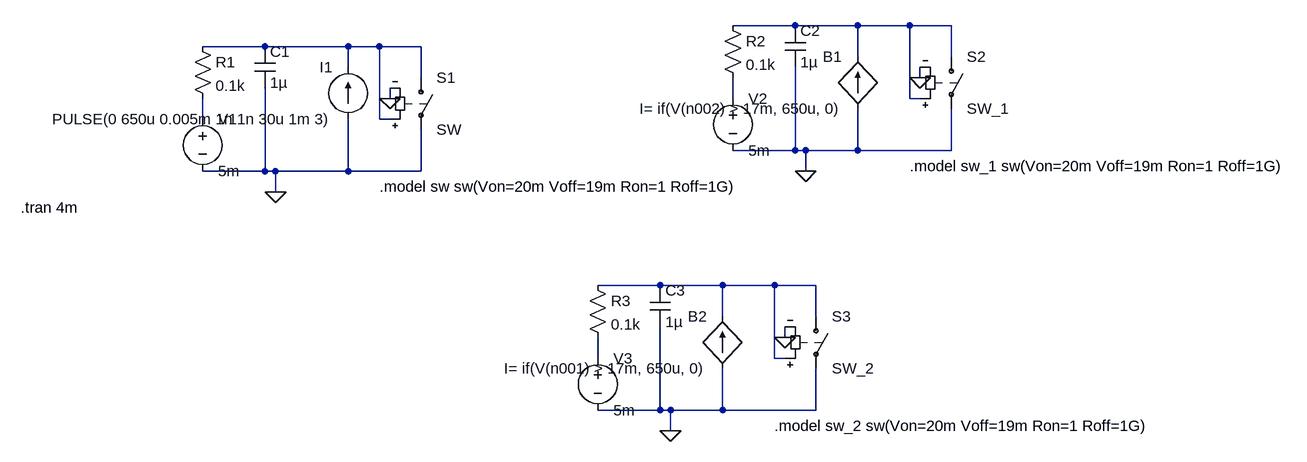
[diagram p0: schematic Neuron_1.asc]
Neuron_1.asc, the LTspice schematic file:
Version 4.1
SHEET 1 1820 708
WIRE 1008 64 912 64
WIRE 1104 64 1008 64
WIRE 1184 64 1104 64
WIRE 1248 64 1184 64
WIRE 192 96 96 96
WIRE 320 96 192 96
WIRE 368 96 320 96
WIRE 432 96 368 96
WIRE 1104 112 1104 64
WIRE 1248 112 1248 64
WIRE 320 128 320 96
WIRE 432 144 432 96
WIRE 1200 144 1200 128
WIRE 384 176 384 160
WIRE 912 176 912 144
WIRE 1184 176 1184 64
WIRE 1200 176 1184 176
WIRE 96 208 96 176
WIRE 368 208 368 96
WIRE 384 208 368 208
WIRE 1008 256 1008 128
WIRE 1008 256 912 256
WIRE 1024 256 1008 256
WIRE 1104 256 1104 192
WIRE 1104 256 1024 256
WIRE 1248 256 1248 192
WIRE 1248 256 1104 256
WIRE 192 288 192 160
WIRE 192 288 96 288
WIRE 208 288 192 288
WIRE 320 288 320 208
WIRE 320 288 208 288
WIRE 432 288 432 224
WIRE 432 288 320 288
WIRE 1024 288 1024 256
WIRE 208 320 208 288
WIRE 800 464 704 464
WIRE 896 464 800 464
WIRE 976 464 896 464
WIRE 1040 464 976 464
WIRE 896 512 896 464
WIRE 1040 512 1040 464
WIRE 992 544 992 528
WIRE 704 576 704 544
WIRE 976 576 976 464
WIRE 992 576 976 576
WIRE 800 656 800 528
WIRE 800 656 704 656
WIRE 816 656 800 656
WIRE 896 656 896 592
WIRE 896 656 816 656
WIRE 1040 656 1040 592
WIRE 1040 656 896 656
WIRE 816 688 816 656
FLAG 208 320 0
FLAG 384 176 0
FLAG 1024 288 0
FLAG 1200 144 0
FLAG 816 688 0
FLAG 992 544 0
SYMBOL res 80 80 R0
SYMATTR InstName R1
SYMATTR Value 0.1k
SYMBOL cap 176 96 R0
SYMATTR InstName C1
SYMATTR Value 1µ
SYMBOL voltage 96 192 R0
SYMATTR InstName V1
SYMATTR Value 5m
SYMBOL current 320 208 R180
WINDOW 0 24 80 Left 2
WINDOW 3 24 0 Left 2
WINDOW 123 0 0 Left 0
WINDOW 39 0 0 Left 0
SYMATTR InstName I1
SYMATTR Value PULSE(0 650u 0.005m 1n 1n 30u 1m 3)
SYMBOL sw 432 128 R0
SYMATTR InstName S1
SYMBOL res 896 48 R0
SYMATTR InstName R2
SYMATTR Value 0.1k
SYMBOL cap 992 64 R0
SYMATTR InstName C2
SYMATTR Value 1µ
SYMBOL voltage 912 160 R0
SYMATTR InstName V2
SYMATTR Value 5m
SYMBOL sw 1248 96 R0
SYMATTR InstName S2
SYMATTR Value SW_1
SYMBOL bi 1104 192 R180
WINDOW 0 24 80 Left 2
WINDOW 3 24 0 Left 2
SYMATTR InstName B1
SYMATTR Value I= if(V(n002) > 17m, 650u, 0)
SYMBOL res 688 448 R0
SYMATTR InstName R3
SYMATTR Value 0.1k
SYMBOL cap 784 464 R0
SYMATTR InstName C3
SYMATTR Value 1µ
SYMBOL voltage 704 560 R0
SYMATTR InstName V3
SYMATTR Value 5m
SYMBOL sw 1040 496 R0
SYMATTR InstName S3
SYMATTR Value SW_2
SYMBOL bi 896 592 R180
WINDOW 0 24 80 Left 2
WINDOW 3 24 0 Left 2
SYMATTR InstName B2
SYMATTR Value I= if(V(n001) > 17m, 650u, 0)
TEXT -184 344 Left 2 !.tran 4m
TEXT 368 312 Left 2 !.model sw sw(Von=20m Voff=19m Ron=1 Roff=1G)
TEXT 1184 280 Left 2 !.model sw_1 sw(Von=20m Voff=19m Ron=1 Roff=1G)
TEXT 976 680 Left 2 !.model sw_2 sw(Von=20m Voff=19m Ron=1 Roff=1G)

The netlist it stands for:
* Neuron_1.asc
R1 N002 N004 0.1k
C1 N002 0 1µ
V1 N004 0 5m
I1 0 N002 PULSE(0 650u 0.005m 1n 1n 30u 1m 3)
S1 N002 0 N002 0 SW
R2 N001 N003 0.1k
C2 N001 0 1µ
V2 N003 0 5m
S2 N001 0 N001 0 SW_1
B1 0 N001 I= if(V(n002) > 17m, 650u, 0)
R3 N005 N006 0.1k
C3 N005 0 1µ
V3 N006 0 5m
S3 N005 0 N005 0 SW_2
B2 0 N005 I= if(V(n001) > 17m, 650u, 0)
.tran 4m
.model sw sw(Von=20m Voff=19m Ron=1 Roff=1G)
.model sw_1 sw(Von=20m Voff=19m Ron=1 Roff=1G)
.model sw_2 sw(Von=20m Voff=19m Ron=1 Roff=1G)
.backanno
.end